# Altium schematic sheet XBee.SchDoc
size A
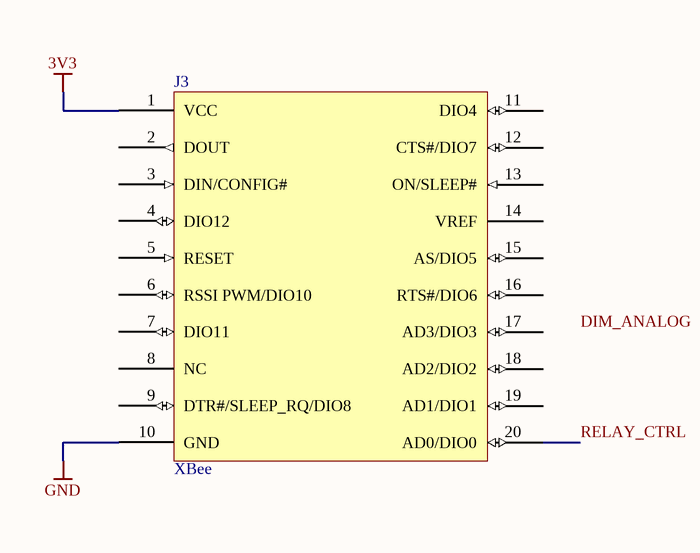
[diagram p0: XBee.SchDoc]

## Parts
J3  XBee  [XBEE]

## Nets
3V3: J3.1(VCC)
GND: J3.10(GND)
RELAY_CTRL: J3.20(AD0/DIO0)

Not connected (* = marked no-connect by the designer): J3 2(DOUT) 3(DIN/CONFIG#) 4(DIO12) 5(RESET) 6(RSSI_PWM/DIO10) 7(DIO11) 8(NC) 9(DTR#/SLEEP_RQ/DIO8) 11(DIO4) 12(CTS#/DIO7) 13(ON/SLEEP#) 14(VREF) 15(AS/DIO5) 16(RTS#/DIO6) 17(AD3/DIO3) 18(AD2/DIO2) 19(AD1/DIO1)

## Notes on the sheet
- Labels drawn without touching a wire or pin: DIM_ANALOG

## Library data of the parts
J3 = J_XBEE_XBEE